# EAGLE design synth-zodiac-sagittarius-speaker (EAGLE 9.6.2)
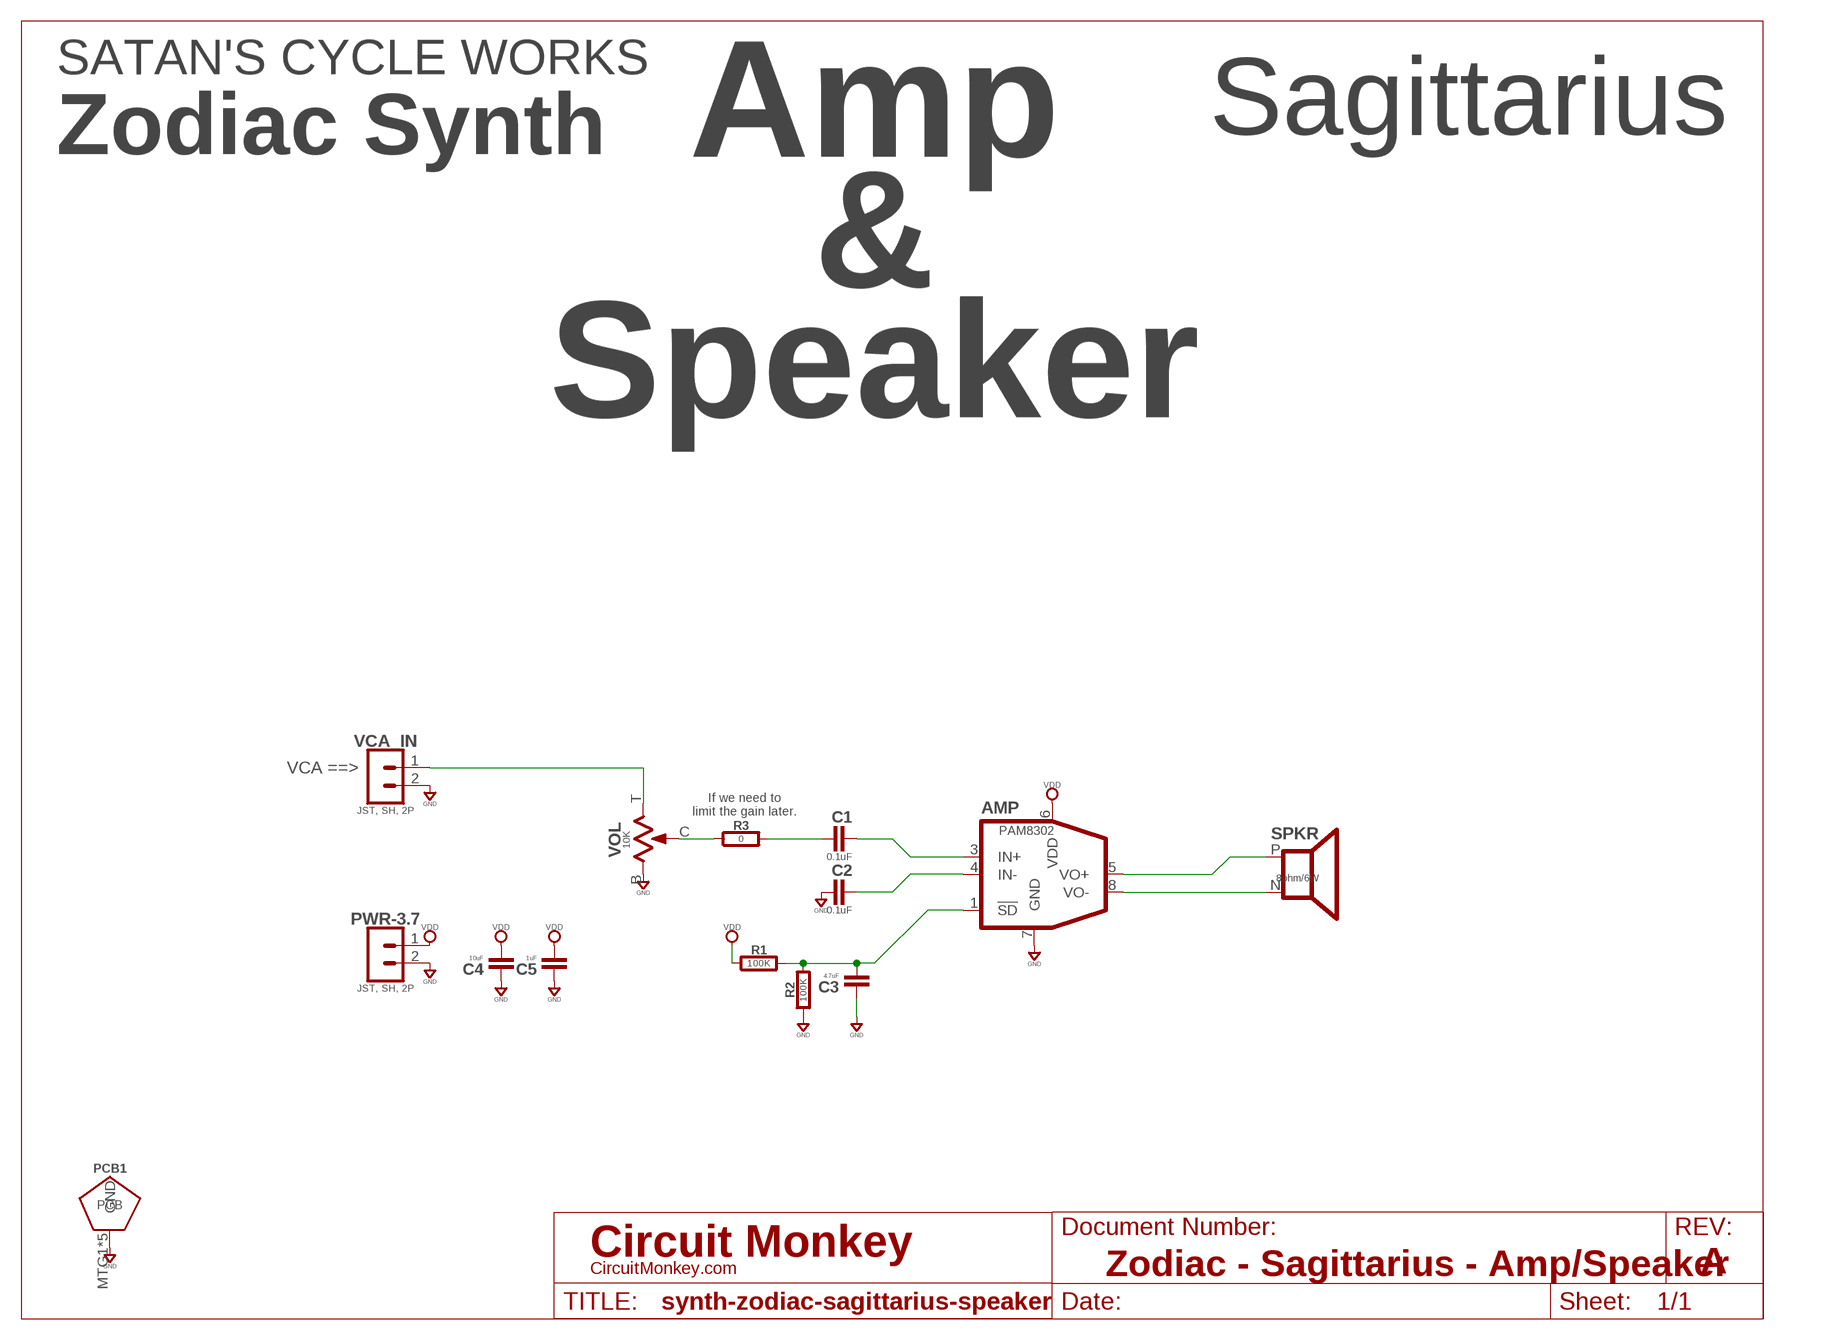
[diagram p0: schematic, sheet 1]
SHEET2 (LETTER_L-CIRCUITMONKEY): DOCUMENT_NUMBER: Zodiac - Sagittarius - Amp/Speaker; REV: A

## Parts
AMP  PAM8302  PAM8302-DFN  [U-DFN3030-8]
C1  0.1uF  CAPACITOR0603  [0603-CAP]
C2  0.1uF  CAPACITOR0603  [0603-CAP]
C3  4.7uF  CAPACITOR0603  [0603-CAP]
C4  10uF  CAPACITOR0603  [0603-CAP]
C5  1uF  CAPACITOR0603  [0603-CAP]
PCB1  PCB FAB  PENTAGON-40R  [PENTAGON-40MM-RAD]
PWR-3.7  JST, SH, 2P  02P-SM-VT-SMT  [BM02B-SRSS-TB]
R1  100K  RESISTOR0603  [0603-RES]
R2  100K  RESISTOR0603  [0603-RES]
R3  0  RESISTOR0603  [0603-RES]
SPKR  8ohm/6W  SPEAKER-40X30-PADS-SMT  [SPKR-40X30]
VCA_IN  JST, SH, 2P  02P-SM-VT-SMT  [BM02B-SRSS-TB]
VOL  10K  TRIMPOT9MM_PCB_SHAFT  [POT-RV9110]

## Nets
GND: AMP.7(GND) C2.1 C3.1 C4.1 C5.1 PCB1.MTG1(GND) PCB1.MTG2(GND) PCB1.MTG3(GND) PCB1.MTG4(GND) PCB1.MTG5(GND) PWR-3.7.2 R2.1 VCA_IN.2 VOL.B
N$1: AMP.3(IN+) C1.2
N$2: AMP.4(IN-) C2.2
N$3: VCA_IN.1 VOL.T
N$4: C1.1 R3.2
N$5: AMP.1(!SD) C3.2 R1.2 R2.2
N$6: AMP.5(VO+) SPKR.P(+)
N$7: AMP.8(VO-) SPKR.N(-)
N$8: R3.1 VOL.C
VDD: AMP.6(VDD) C4.2 C5.2 PWR-3.7.1 R1.1

## Notes on the sheet
- Amp
  &
  Speaker
- Sagittarius
- SATAN'S CYCLE WORKS
- Zodiac Synth
- VCA ==>
- If we need to
  limit the gain later.

## Library data of the parts
AMP = audio:PAM8302: PAM8302 Class-D Mono Amplifier; COST01: 0.70; COST10: 0.60; COST100: 0.46; MFR: Diodes, Inc.; MPN: PAM8302AAYC
C1-C5 = rlc:CAPACITOR: Capacitor; COST01: 0.12; COST10: 0.09; COST100: 0.05
PCB1 = circuit-monkey-zodiac:PENTAGON: Pentagram shaped PCB
PWR-3.7 VCA_IN = con-jst:02P: 2 pin connector; COST01: 0.45; COST10: 0.4; COST100: 0.35; MFR: JST; MPN: BMB02B-SRSS-TB
R1-R3 = rlc:RESISTOR: Resistor; COST01: 0.10; COST10: 0.05; COST100: 0.02
SPKR = audio:SPEAKER: Speaker; COST01: 6.75; COST10: 5.60; COST100: 5.10; MFR: CUI; MPN: CDS-40288
VOL = rlc:TRIMPOT: Potentiometer; COST01: 0.70; COST10: 0.60; COST100: 0.60; MFR: Tayda; MPN: RV9110NO-OS15A00; SKU: A-5517

## Board
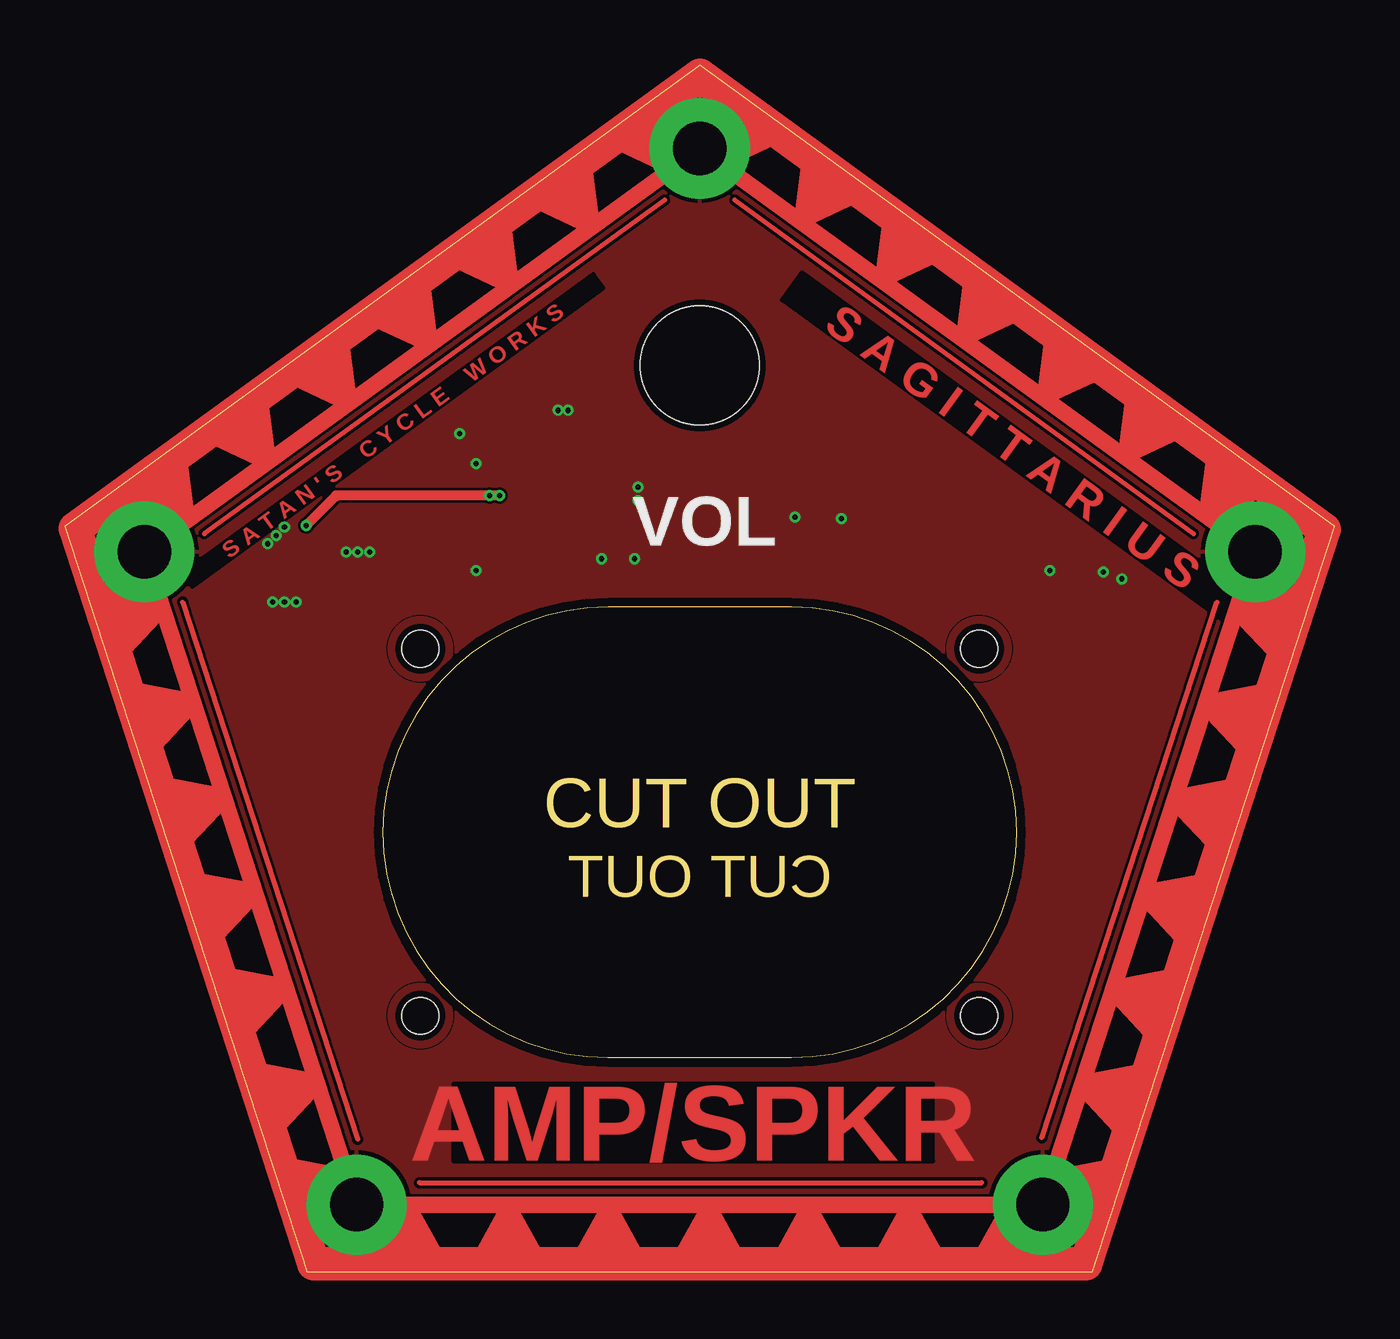
[diagram p1: board, top side]
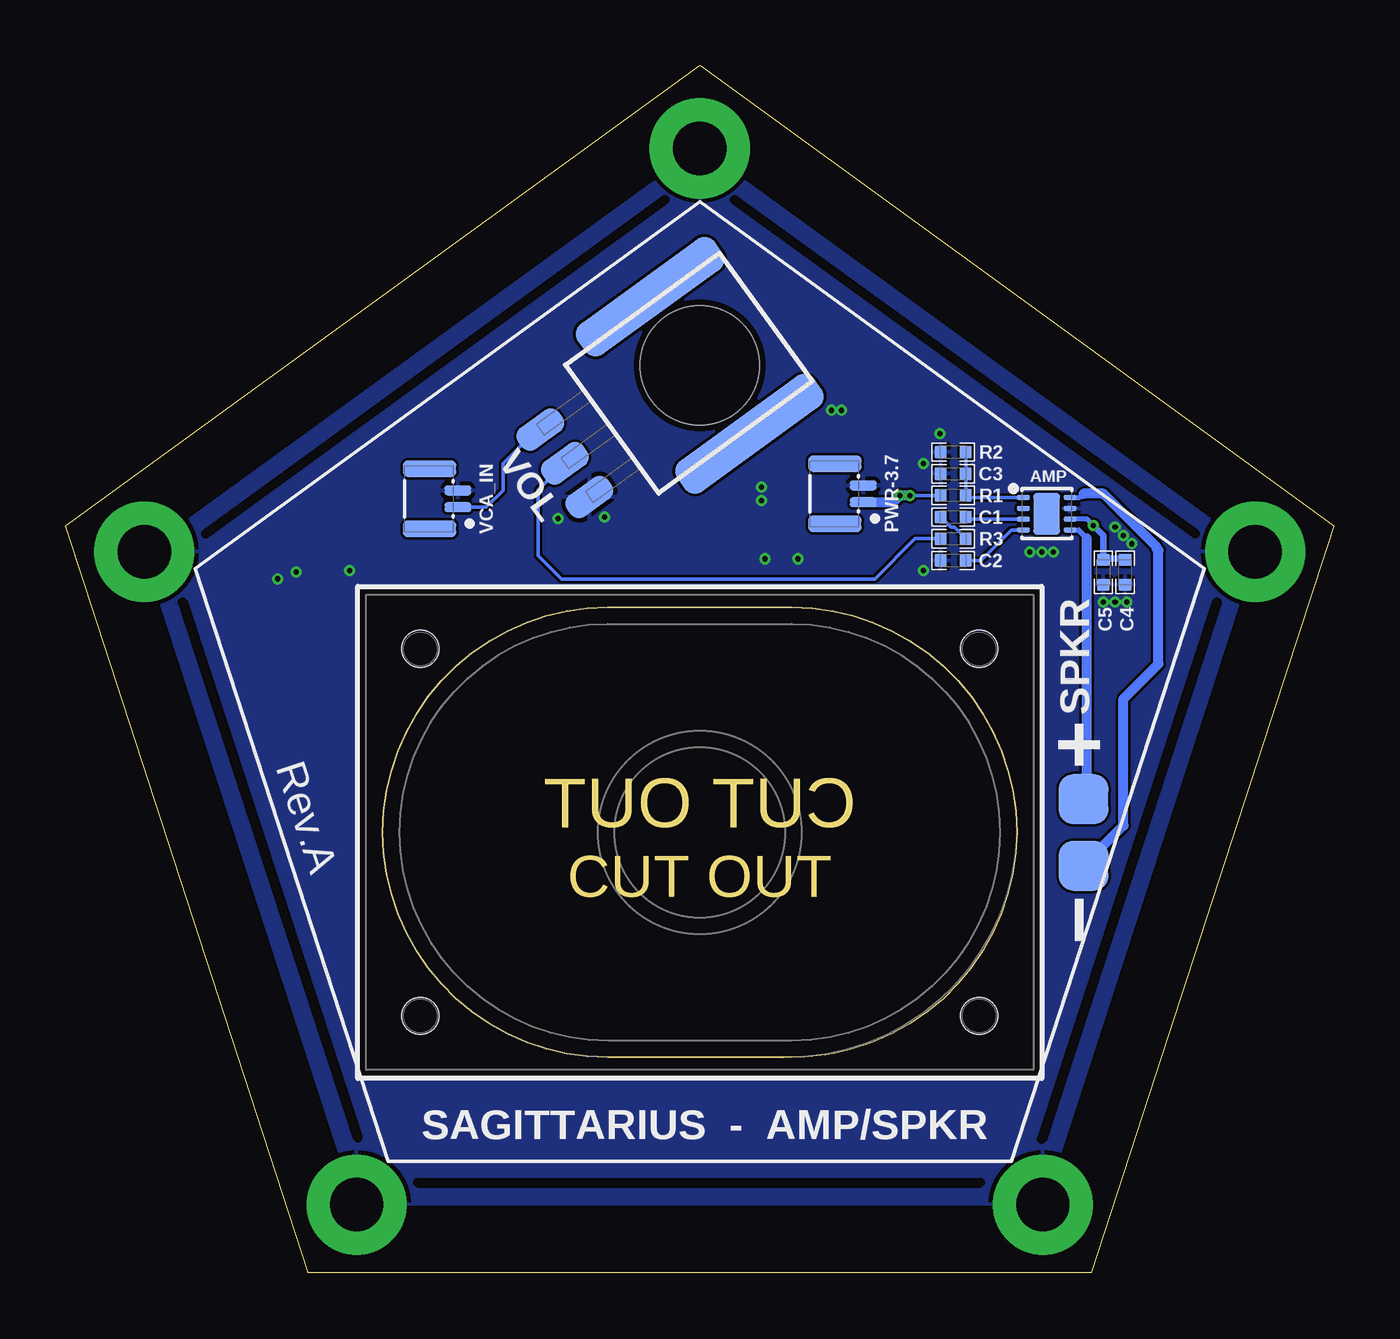
[diagram p2: board, bottom side, seen from below]

Size 76.08 x 72.36 mm. Coordinates in mm from the lower left corner, seen from the top.
Copper layers (1*16): Top 0.0356mm / dielectric 1.5011mm / Bottom 0.0356mm
Design rules "OSH-CircuitMonkey *": minimum track width 6mil, minimum drill 12mil, track to track 6mil, track to pad 6mil, pad to pad 6mil, via to via 6mil, smd to smd 6mil, copper to edge 15mil, drill to drill 6mil, minimum pad ring 7mil, minimum via ring 7mil, stop-mask expansion 3mil, vias tented up to drill 15mil, thermal gap 10mil

### Footprints (pad centres in the part's own frame; a part is rotated, then mirrored left to right if it is on the bottom)
U-DFN3030-8 = smd 0.3 x 0.8: 1 -0.975,-1.4; 2 -0.325,-1.4; 3 0.325,-1.4; 4 0.975,-1.4; 5 0.975,1.4; 6 0.325,1.4; 7 -0.325,1.4; 8 -0.975,1.4 | smd 2.5 x 1.6: PAD 0,0
0603-CAP = smd 0.711 x 0.762: 1 -0.752,0; 2 0.752,0
PENTAGON-40MM-RAD = drill 3.2 pad 6: MTG1 0,35; MTG2 33.3,10.82; MTG3 20.57,-28.32; MTG4 -20.57,-28.32; MTG5 -33.3,10.82
BM02B-SRSS-TB = smd 0.6 x 1.6: 1 -0.5,-0.3; 2 0.5,-0.3 | smd 1 x 3.2: MTG1 1.8,1.4; MTG2 -1.8,1.4
0603-RES = smd 0.711 x 0.762: 1 -0.752,0; 2 0.752,0
SPKR-40X30 = smd 3 x 3: N -23,2; P -23,-2 | hole 2.2: -16.75,11; 16.75,11; 16.75,-11; -16.75,-11
POT-RV9110 = smd 1.6 x 3: B 2.5,-10; C 0,-10; T -2.5,-10 | smd 2.286 x 10.16: MNT1 -5.08,0; MNT2 5.08,0 | hole 7.1: 0,0

### Placement (x,y rotation side)
AMP  17.24,45.46 270 bottom
C1  22.84,45.26 0 bottom
C2  22.84,42.66 0 bottom
C3  22.84,47.86 0 bottom
C4  12.54,41.96 90 bottom
C5  13.84,41.96 90 bottom
PCB1  38.04,32.36 0 top
PWR-3.7  28.54,46.66 90 bottom
R1  22.84,46.56 0 bottom
R2  22.84,49.16 0 bottom
R3  22.84,43.96 0 bottom
SPKR  38.04,26.36 180 bottom
VCA_IN  52.84,46.36 90 bottom
VOL  38.04,54.36 306 bottom

### Tracks (layer width: path | path; a pad name or v marks a point on that pad's centre or on a via)
GND  (via drill 0.3)
  other vias: 13.14,44.66 12.64,44.16 12.14,43.66 32.14,42.76 34.14,42.76 34.34,46.26 34.34,47.06 30.14,51.66 29.54,51.66 18.24,43.16 17.54,43.16 16.84,43.16 46.54,45.16 43.74,45.26 59.04,42.06 62.24,41.96 63.34,41.56 23.64,50.26 24.64,48.46 24.64,42.06 13.14,40.16 12.44,40.16 13.84,40.16
  pour Bottom: 17.44,4.06 58.64,4.06 71.34,43.16 38.04,67.36 4.74,43.16
  pour Top: 17.44,3.96 58.64,3.96 71.34,43.06 38.04,67.26 4.74,43.06
N$1
  Bottom 0.2: AMP.3 21.96,45.14 C1.2
N$2
  Bottom 0.2: AMP.4 19.37,44.49 21.19,42.66 C2.2
N$3
  Bottom 0.2: VCA_IN.1 50.84,45.86 49.84,46.86 49.84,48.46 47.8,50.51 VOL.T
N$4
  Bottom 0.2: C1.1 22.99,44.66 22.79,44.66 R3.2
N$5
  Bottom 0.2: AMP.1 21.96,46.44 R1.2 C3.2 R2.2
N$6
  Bottom 0.3: AMP.5 15.34,44.49 14.84,43.99
  Bottom 0.6: SPKR.P 14.84,28.56 14.84,43.99
N$7
  Bottom 0.3: AMP.8 15.27,46.44 15.04,46.66
  Bottom 0.6: SPKR.N 12.64,26.76 12.64,34.36 10.54,36.46 10.54,43.26 10.64,43.36 10.64,43.46 13.84,46.66 15.04,46.66
N$8
  Bottom 0.2: R3.1 25.14,43.96 27.54,41.56 46.34,41.56 47.74,42.96 47.74,46.87 VOL.C
VDD  (via drill 0.3)
  Top 0.6: v14.44,44.76 16.24,46.56 16.24,46.53 16.26,46.51 16.32,46.56 v26.04,46.56
  Bottom 0.2: R1.1 v25.44,46.56
  Bottom 0.3: v14.44,44.76 14.82,45.14 AMP.6
  Bottom 0.4: C5.2 13.84,42.76 | 13.84,42.76 13.84,44.16 v14.44,44.76 | C4.2 12.59,42.76 13.84,42.76
  Bottom 0.6: PWR-3.7.1 26.44,46.16 v26.04,46.56 v25.44,46.56

### Text on the board
Top: S A T A N ' S C Y C L E W O R K S | S A G I T T A R I U S | AMP/SPKR
Dimension: CUT OUT
bPlace: Rev.A | SAGITTARIUS - AMP/SPKR
tStop: S A T A N ' S C Y C L E W O R K S | S A G I T T A R I U S | AMP/SPKR